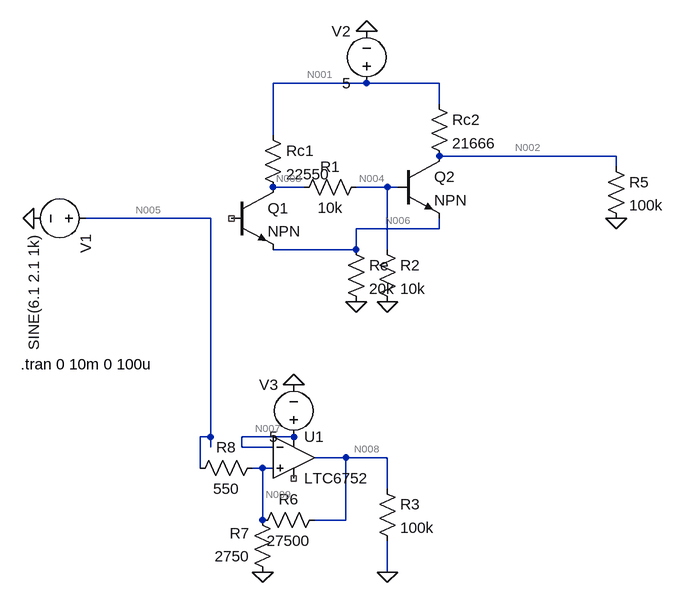
[diagram p0: schematic Draft2.asc]
Draft2.asc, the LTspice schematic file:
Version 4
SHEET 1 880 804
WIRE 304 32 160 32
WIRE 416 32 304 32
WIRE 416 64 416 32
WIRE 160 112 160 32
WIRE 688 144 416 144
WIRE 688 160 688 144
WIRE 208 192 160 192
WIRE 336 192 288 192
WIRE 352 192 336 192
WIRE 64 240 -128 240
WIRE 416 256 416 240
WIRE 416 256 288 256
WIRE 288 288 288 256
WIRE 288 288 160 288
WIRE 336 288 336 192
WIRE 64 576 64 240
WIRE 64 576 48 576
WIRE 192 576 112 576
WIRE 64 592 64 576
WIRE 112 592 112 576
WIRE 160 592 112 592
WIRE 272 608 224 608
WIRE 336 608 272 608
WIRE 48 624 48 576
WIRE 144 624 128 624
WIRE 160 624 144 624
WIRE 336 656 336 608
WIRE 144 704 144 624
WIRE 272 704 272 608
WIRE 272 704 224 704
WIRE 336 784 336 736
FLAG 288 368 0
FLAG 336 368 0
FLAG -208 240 0
FLAG 304 -48 0
FLAG 688 240 0
FLAG 192 496 0
FLAG 336 784 0
FLAG 144 784 0
SYMBOL npn 96 192 R0
SYMATTR InstName Q1
SYMBOL npn 352 144 R0
SYMATTR InstName Q2
SYMBOL res 304 176 R90
WINDOW 0 0 56 VBottom 2
WINDOW 3 32 56 VTop 2
SYMATTR InstName R1
SYMATTR Value 10k
SYMBOL res 144 96 R0
SYMATTR InstName Rc1
SYMATTR Value 22550
SYMBOL res 400 48 R0
SYMATTR InstName Rc2
SYMATTR Value 21666
SYMBOL res 272 272 R0
SYMATTR InstName Re
SYMATTR Value 20k
SYMBOL res 320 272 R0
SYMATTR InstName R2
SYMATTR Value 10k
SYMBOL voltage -112 240 R90
WINDOW 123 0 0 Left 0
WINDOW 39 0 0 Left 0
SYMATTR InstName V1
SYMATTR Value SINE(6.1 2.1 1k)
SYMBOL voltage 304 48 R180
WINDOW 0 24 96 Left 2
WINDOW 3 24 16 Left 2
WINDOW 123 0 0 Left 0
WINDOW 39 0 0 Left 0
SYMATTR InstName V2
SYMATTR Value 5
SYMBOL res 672 144 R0
SYMATTR InstName R5
SYMATTR Value 100k
SYMBOL Comparators\\LTC6752 192 544 R0
SYMATTR InstName U1
SYMBOL voltage 192 592 R180
WINDOW 0 24 96 Left 2
WINDOW 3 24 16 Left 2
SYMATTR InstName V3
SYMATTR Value 5
SYMBOL res 240 688 R90
WINDOW 0 0 56 VBottom 2
WINDOW 3 32 56 VTop 2
SYMATTR InstName R6
SYMATTR Value 27500
SYMBOL res 160 800 R180
WINDOW 0 36 76 Left 2
WINDOW 3 36 40 Left 2
SYMATTR InstName R7
SYMATTR Value 2750
SYMBOL res 32 640 R270
WINDOW 0 32 56 VTop 2
WINDOW 3 0 56 VBottom 2
SYMATTR InstName R8
SYMATTR Value 550
SYMBOL res 320 640 R0
SYMATTR InstName R3
SYMATTR Value 100k
TEXT -228 464 Left 2 !.tran 0 10m 0 100u

The netlist it stands for:
* Draft2.asc
Q1 N003 NC_01 N006 0 NPN
Q2 N002 N004 N006 0 NPN
R1 N004 N003 10k
Rc1 N001 N003 22550
Rc2 N001 N002 21666
Re N006 0 20k
R2 N004 0 10k
V1 N005 0 SINE(6.1 2.1 1k)
V2 N001 0 5
R5 N002 0 100k
XU1 N009 N007 N007 NC_02 N008 LTC6752  ; pins In+ In- V+ V- OUT
V3 N007 0 5
R6 N008 N009 27500
R7 0 N009 2750
R8 N005 N009 550
R3 N008 0 100k
.model NPN NPN
.model PNP PNP
.lib standard.bjt
.tran 0 10m 0 100u
.lib LTC7.lib
.backanno
.end

* Results of the author's LTspice run, read from the files saved beside the schematic
* Operating Point, zero values left out:
*   V(n003) = 2.349 V
*   V(n006) = 494.9 mV
*   V(n002) = 3.673 V
*   V(n004) = 1.173 V
*   V(n001) = 5 V
*   V(n005) = 6.1 V
*   V(n007) = 5 V
*   V(n009) = 5.072 V
*   V(n008) = 4.395 V
*   Ic(Q2) = 24.5 µA
*   Ib(Q2) = 245 nA
*   Ie(Q2) = -24.75 µA
*   Ic(Q1) = 114.8 pA
*   Ie(Q1) = -114.8 pA
*   I(R3) = 43.95 µA
*   I(R8) = 1.87 mA
*   I(R7) = -1.844 mA
*   I(R6) = -24.61 µA
*   I(R5) = 36.73 µA
*   I(R2) = 117.3 µA
*   I(Re) = 24.75 µA
*   I(Rc2) = 61.23 µA
*   I(Rc1) = 117.6 µA
*   I(R1) = -117.6 µA
*   I(V3) = -18.6 µA
*   I(V2) = -178.8 µA
*   I(V1) = -1.87 mA
*   Ix(u1:1) = 741.5 nA
*   Ix(u1:2) = -733.8 nA
*   Ix(u1:3) = 19.33 µA
*   Ix(u1:5) = -19.34 µA
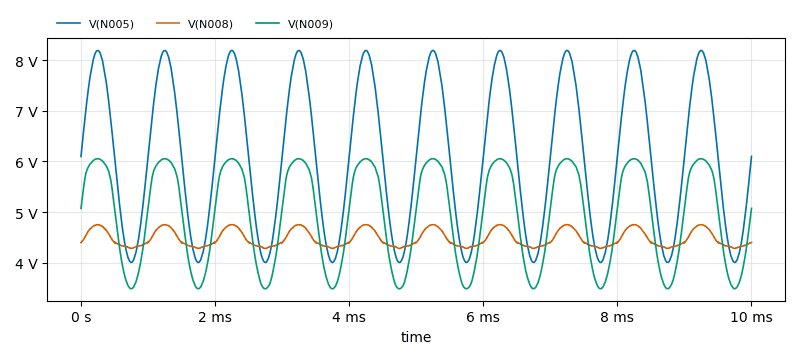
[diagram p1: Transient Analysis of Draft2.asc, plotted from the saved traces]
* Transient Analysis, 1 run:
*   V(N005): min 4 V, max 8.2 V, average 6.099 V, rms 6.277 V, last 6.1 V
*   V(N008): min 4.28 V, max 4.749 V, average 4.474 V, rms 4.477 V, last 4.395 V
*   V(N009): min 3.48 V, max 6.055 V, average 4.919 V, rms 5.014 V, last 5.072 V